# Altium schematic sheet source_iref_gen.SchDoc
size 254 x 88 mm; SheetNumber: 11; SheetTotal: 13
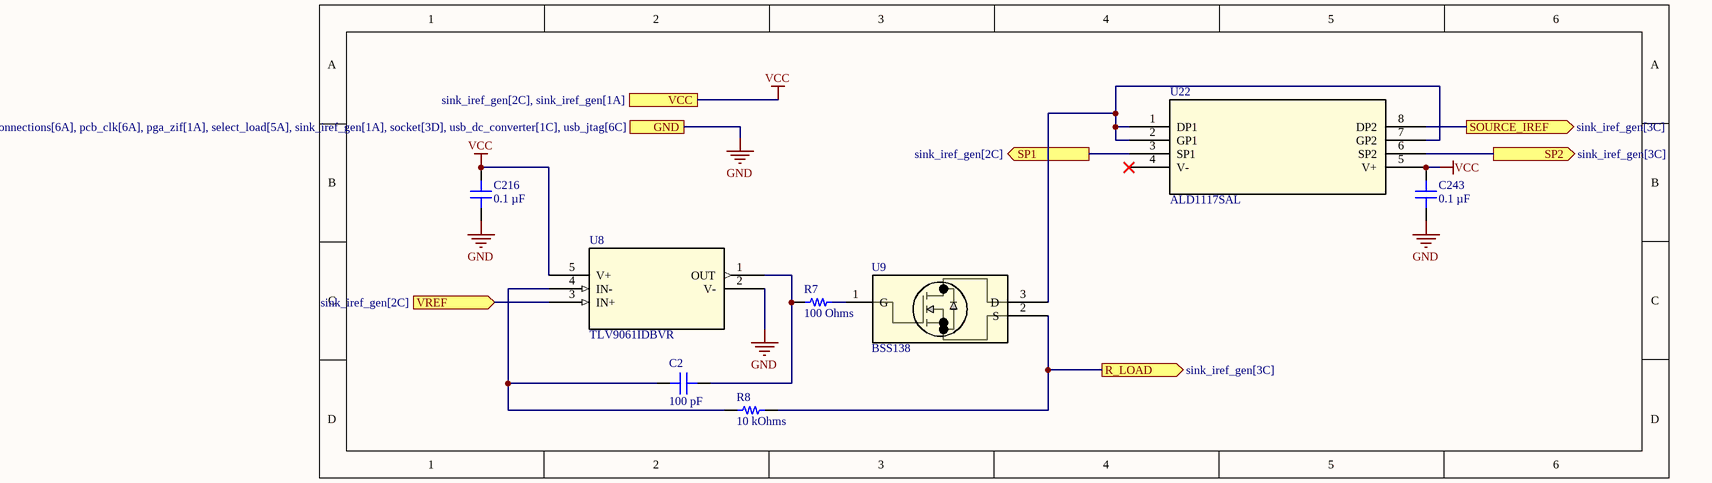
[diagram p0: source_iref_gen.SchDoc]

## Parts
C2  100 pF  [CAP 0805_2012]
C216  0.1 µF  [CAP 0805_2012]
C243  0.1 µF  [CAP 0805_2012]
R7  100 Ohms  [RES 0805_2012]
R8  10 kOhms  [RES 0805_2012]
U8  TLV9061IDBVR  [DBV5_TEX]
U9  BSS138  [SOT-23_3L_ONS]
U22  ALD1117SAL  [8-SOIC_ALD]

## Ports
GND (see sink_iref_gen[2D], analog_refs[3B], digital_socket[6A], fmc_connections[6A], pcb_clk[6A], pga_zif[1A], select_load[5A], sink_iref_gen[1A], socket[3D], usb_dc_converter[1C], usb_jtag[6C]), R_LOAD (out, see sink_iref_gen[3C]), SOURCE_IREF (out, see sink_iref_gen[3C]), SP1 (out, see sink_iref_gen[2C]), SP2 (out, see sink_iref_gen[3C]), VCC (see sink_iref_gen[2C], sink_iref_gen[1A]), VREF (in, see sink_iref_gen[2C])

## Nets
GND: C216.1 C243.1 U8.2(V-) ; port GND
VCC: C216.2 C243.2 U8.5(V+) U22.5(V+) ; port VCC
R_LOAD: R8.2 U9.2(S) ; port R_LOAD
SOURCE_IREF: U22.8(DP2) ; port SOURCE_IREF
SP1: U22.3(SP1) ; port SP1
SP2: U22.6(SP2) ; port SP2
VREF: U8.3(IN+) ; port VREF
NetC2_1: C2.1 R8.1 U8.4(IN-)
NetC2_2: C2.2 R7.2 U8.1(OUT)
NetR7_1: R7.1 U9.1(G)
NetU9_3: U9.3(D) U22.1(DP1) U22.2(GP1) U22.7(GP2)

Not connected (* = marked no-connect by the designer): U22 4(V-)*

## Library data of the parts
C2 = 500R15N101JV4T: CAP CER 100PF 50V C0G/NP0 0805; manufacturer: Johanson Dielectrics Inc.; Temperature Coefficient: C0G, NP0; Tolerance: ±5%; Part Number: 500R15N101JV4T; Capacitance: 100 pF; Applications: General Purpose; componentlink1description: Datasheet; componentlink1url: https://www.johansondielectrics.com/downloads/catalog/johanson-dielectrics-product-catalog.pdf; componentlink2description: DigiKey Link; componentlink2url: https://www.digikey.com/en/products/detail/johanson-dielectrics-inc/500R15N101JV4T/1859421; Device Package: 0805 (2012 Metric); lastupdated: 4/6/2026 7:32:47 PM; Lifecycle Status: Active; Minimum Order: 1; Mounting Type: Surface Mount, MLCC; Operating Temperature: -55°C ~ 125°C; Package / Case: 0805 (2012 Metric); packaging: TapeAndReel; partid: 11835; Part Status: Active; price: 0.02; series: -; Size / Dimension: 0.080" L x 0.050" W (2.03mm x 1.27mm); Supplier 1: DigiKey; Supplier Part Number 1: 709-1176-1-ND; Thickness (Max): 0.050" (1.27mm); value: 100 pF; Voltage - Rated: 50V
C216 C243 = 160R15W104KV4T: CAP CER 0.1UF 16V X7R 0805; manufacturer: Johanson Dielectrics Inc.; Tolerance: ±10%; Part Number: 160R15W104KV4T; Capacitance: 0.1 µF; Applications: General Purpose; componentlink1description: Datasheet; componentlink1url: https://www.johansondielectrics.com/downloads/catalog/johanson-dielectrics-product-catalog.pdf; componentlink2description: DigiKey Link; componentlink2url: https://www.digikey.com/en/products/detail/johanson-dielectrics-inc/160R15W104KV4T/1859428; Device Package: 0805 (2012 Metric); lastupdated: 4/6/2026 7:32:57 PM; Lifecycle Status: Active; Minimum Order: 1; Mounting Type: Surface Mount, MLCC; Operating Temperature: -55°C ~ 125°C; Package / Case: 0805 (2012 Metric); packaging: TapeAndReel; partid: 9125; Part Status: Active; price: 0.03; series: -; Size / Dimension: 0.080" L x 0.050" W (2.03mm x 1.27mm); Supplier 1: DigiKey; Supplier Part Number 1: 709-1183-1-ND; Temperature Coefficient: X7R; Thickness (Max): 0.050" (1.27mm); value: 0.1 µF; Voltage - Rated: 16V
R7 = RCS0805100RFKEA: RES SMD 100 OHM 1% 3/4W 0805; Manufacturer: Vishay Dale; Power (Watts): 0.75W, 3/4W; Temperature Coefficient: ±100ppm/°C; Part Number: RCS0805100RFKEA; Value: 100 Ohms; ComponentLink1Description: Datasheet; ComponentLink1URL: http://www.vishay.com/docs/20065/rcse3.pdf; ComponentLink2Description: DigiKey Link; ComponentLink2URL: https://www.digikey.com/en/products/detail/vishay-dale/RCS0805100RFKEA/5866980; Composition: Thick Film; Device Package: 0805 (2012 Metric); Features: Automotive AEC-Q200, Pulse Withstanding; Height - Seated (Max): 0.020" (0.50mm); LastUpdated: 4/5/2026 8:11:26 PM; Lifecycle Status: Active; Minimum Order: 1; Number of Terminations: 2; Operating Temperature: -55°C ~ 155°C; Package / Case: 0805 (2012 Metric); Packaging: TapeAndReel; PartId: 27784; Part Status: Active; Price: 0.02; Ratings: AEC-Q200; Resistance: 100 Ohms; Series: RCS e3; Size / Dimension: 0.079" L x 0.049" W (2.00mm x 1.25mm); Supplier 1: DigiKey; Supplier Part Number 1: 541-2834-1-ND; Supplier Device Package: 0805; Tolerance: ±1%
R8 = RNCS0805BKE10K0: RES 10K OHM 0.1% 1/10W 0805; Manufacturer: Stackpole Electronics Inc; Power (Watts): 0.1W, 1/10W; Temperature Coefficient: ±25ppm/°C; Part Number: RNCS0805BKE10K0; Value: 10 kOhms; ComponentLink1Description: Datasheet; ComponentLink1URL: https://www.seielect.com/catalog/sei-rncs_rnch.pdf; ComponentLink2Description: DigiKey Link; ComponentLink2URL: https://www.digikey.com/en/products/detail/stackpole-electronics-inc/RNCS0805BKE10K0/1800067; Composition: Thin Film; Device Package: 0805 (2012 Metric); Features: Anti-Corrosive, Automotive AEC-Q200, Moisture Resistant; Height - Seated (Max): 0.026" (0.65mm); LastUpdated: 4/5/2026 8:11:26 PM; Lifecycle Status: Active; Minimum Order: 1; Number of Terminations: 2; Operating Temperature: -55°C ~ 155°C; Package / Case: 0805 (2012 Metric); Packaging: TapeAndReel; PartId: 27713; Part Status: Active; Price: 0.07; Ratings: AEC-Q200; Resistance: 10 kOhms; Series: RNCS; Size / Dimension: 0.079" L x 0.049" W (2.00mm x 1.25mm); Supplier 1: DigiKey; Supplier Part Number 1: RNCS0805BKE10K0CT-ND; Supplier Device Package: 0805; Tolerance: ±0.1%
U8 = TLV9061IDBVR: Single, 5.5-V, 10-MHz, RRIO operational amplifier for cost-optimized applications 5-SOT-23 -40 to 125; Manufacturer_Name: Texas Instruments; Copyright: Copyright (C) 2026 Ultra Librarian. All rights reserved.; Manufacturer_Part_Number: TLV9061IDBVR; RefDes: RefDes; Type: Type
U9 = BSS138: Description; Manufacturer_Name: onsemi; Copyright: Copyright (C) 2025 Ultra Librarian. All rights reserved.; Manufacturer_Part_Number: BSS138; RefDes: RefDes; Type: Type
U22 = ALD1117SAL: No Description Available; Manufacturer_Name: Advanced Linear Devices; Copyright: Copyright (C) 2026 Ultra Librarian. All rights reserved.; Manufacturer_Part_Number: ALD1117SAL; RefDes: RefDes; Type: Type